# Altium project EG701_BMS.PrjPcb (part 2 of 3)
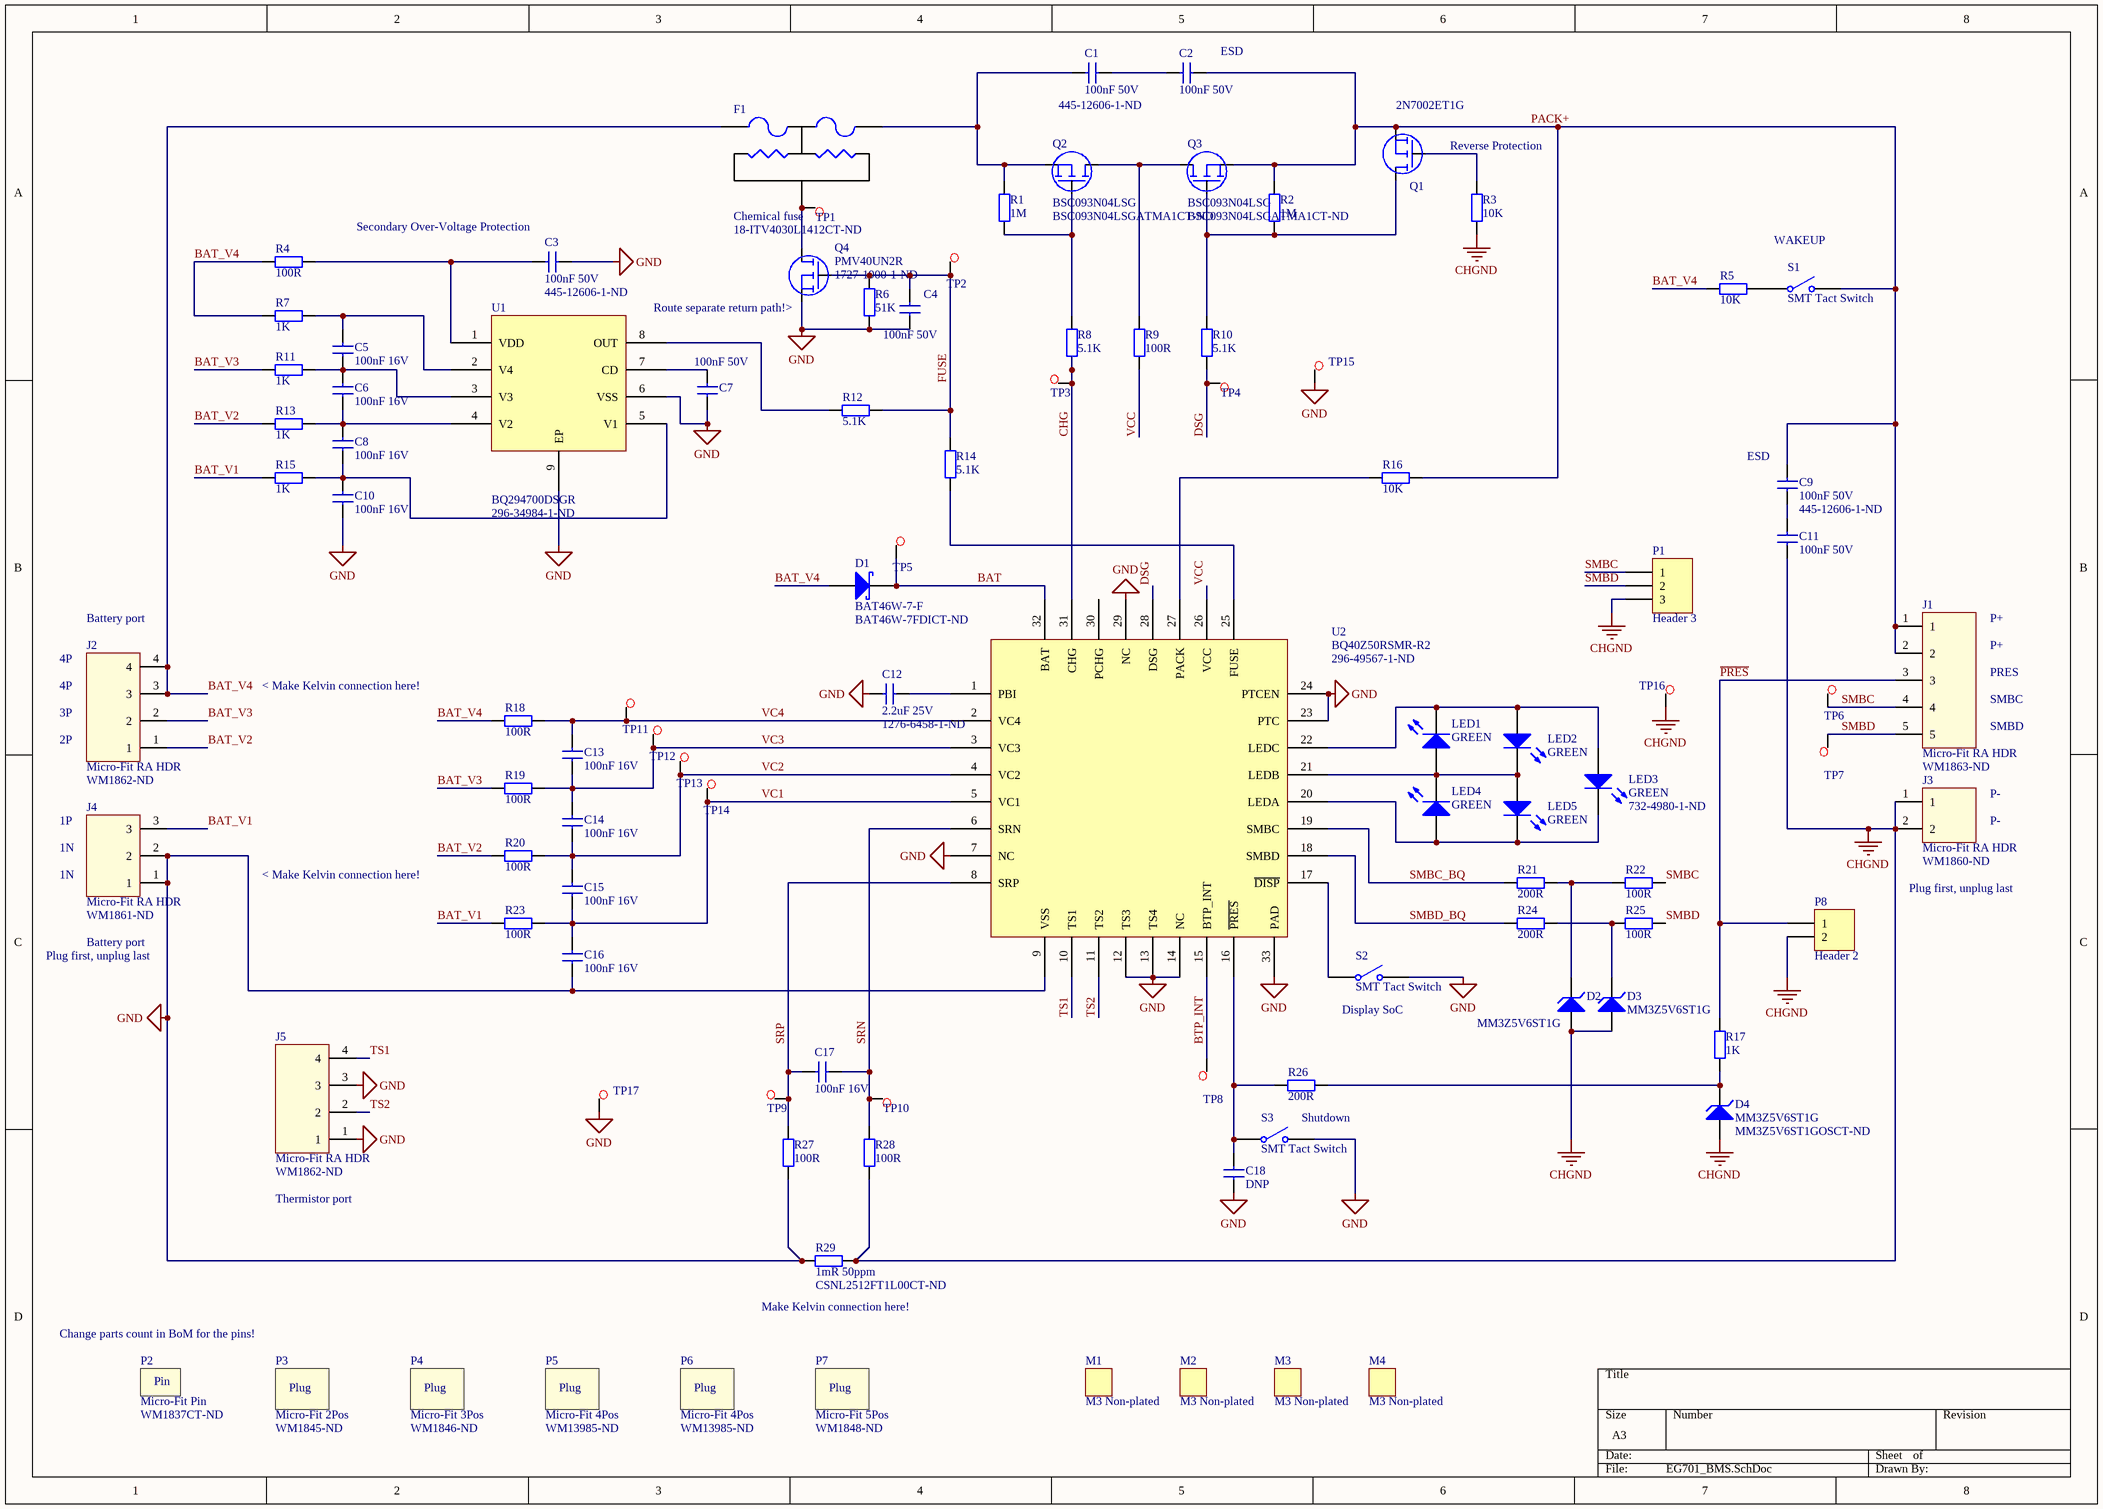
[diagram p1: EG701_BMS.SchDoc]

## Sheet EG701_BMS.SchDoc (continued)
### Library data of the parts
C1-C4 C7 C9 C11 = 100nF_0603_10%_X8R_ 50V: TDK - CGA3E3X8R1H104K080AB - Keramikvielschichtkondensator, SMD, 0.1 µF, 50 V, 0603 [Metrisch 1608], ± 10%, X8R, CGA Series; Supplier 1: Digi-Key; Manufacturer 1: TDK; Manufacturer Part Number 1: CGA3E3X8R1H104K080AB; Stock 1: 311729; Pricing 1: 1=0.23000, 10=0.15900, 100=0.09030, 500=0.06376, 1000=0.05579 (USD); RoHS: Yes; Mount: Surface Mount; Case/Package: 0603; Weight: 7.1E-05oz; Case Code (Imperial): 0603; Case Code (Metric): 1608; Min Operating Temperature: -55°C; Max Operating Temperature: 150°C; Package Quantity: 4000; Packaging: Tape and Reel; Capacitance: 100nF; Tolerance: 10%; Voltage Rating: 50V; Features: High Temperature; Termination: SMD/SMT; Voltage Rating (DC): 50V; Dielectric: X8R; Length: 0.063inch; Height: 0.8mm; Thickness: 0.035inch; Width: 0.8mm; Ratings: AEC-Q200; REACH SVHC: No SVHC; Lead Free: Lead Free; ComponentLink1URL: http://www.mouser.com/ds/2/400/tdk_mlcc_automotive_hightemp_en-549698.pdf?src-supplier=Mouser; ComponentLink1Description: http://www.mouser.com/ds/2/400/tdk_mlcc_automotive_hightemp_en-549698.pdf?src-supplier=Mouser; ComponentLink2URL: http://www.farnell.com/datasheets/2016103.pdf?src-supplier=Farnell; ComponentLink2Description: http://www.farnell.com/datasheets/2016103.pdf?src-supplier=Farnell; ComponentLink3URL: http://product.tdk.com/en/catalog/datasheets/mlcc_automotive_hightemp_en.pdf?src-supplier=Avnet; ComponentLink3Description: http://product.tdk.com/en/catalog/datasheets/mlcc_automotive_hightemp_en.pdf?src-supplier=Avnet; ComponentLink4URL: http://www.farnell.com/datasheets/2016103.pdf?src-supplier=Element14; ComponentLink4Description: http://www.farnell.com/datasheets/2016103.pdf?src-supplier=Element14; ComponentLink5URL: https://product.tdk.com/info/en/documents/chara_sheet/CGA3E3X8R1H104K080AB.pdf?src-supplier=Digi-Key; ComponentLink5Description: https://product.tdk.com/info/en/documents/chara_sheet/CGA3E3X8R1H104K080AB.pdf?src-supplier=Digi-Key; ComponentLink6URL: http://www.farnell.com/datasheets/2016103.pdf?src-supplier=Newark; ComponentLink6Description: http://www.farnell.com/datasheets/2016103.pdf?src-supplier=Newark
  C2 C4 C7 C11: Supplier Part Number 1: 445-12606-1-ND
C5 C6 C8 C10 C13-C17 = 100nF_0603_-20%+80%_Y5V_16V: Cap Ceramic 0.1uF 16V Y5V -20% to 80% SMD 0603 85C Paper T/R; Manufacturer 1: Samsung; Manufacturer Part Number 1: CL10F104ZO8NNNC; Supplier 1: Digi-Key; Stock 1: 7637746; Pricing 1: 1=0.10000, 10=0.03000, 100=0.01360, 500=0.00970, 1000=0.00762 (USD); RoHS: Yes; Mount: Surface Mount; Case/Package: 0603; Case Code (Metric): 1608; Case Code (Imperial): 0603; Min Operating Temperature: -30°C; Max Operating Temperature: 85°C; Capacitance: 100nF; Tolerance: 80%; Package Quantity: 1; Packaging: Tape and Reel; Voltage Rating: 16V; Dielectric: Y5V; Length: 1.6mm; Height: 0.8mm; Width: 0.031inch; Thickness: 0.035inch; Depth: 0.8mm; Radiation Hardening: No; ComponentLink1URL: https://datasheet.ciiva.com/25805/cl10f104zo8nnnc-25805810.pdf?src-supplier=Digi-Key; ComponentLink1Description: https://datasheet.ciiva.com/25805/cl10f104zo8nnnc-25805810.pdf?src-supplier=Digi-Key; ComponentLink2URL: https://datasheet.ciiva.com/16199/cl10f104zo8nnnc-16199254.pdf?src-supplier=Future+Electronics; ComponentLink2Description: https://datasheet.ciiva.com/16199/cl10f104zo8nnnc-16199254.pdf?src-supplier=Future+Electronics; Supplier Part Number 1: 1276-1258-1-ND
C12 = 2U2_0603_10%_X5R_25V: Ceramic capacitor SMD 0805 2.2 µF 25 V 10 %; Manufacturer 1: Samsung; Manufacturer Part Number 1: CL21A225KAFNNNG; Tolerance: 10%; Supplier 1: Digi-Key; Stock 1: 290666; Pricing 1: 1=0.15000, 10=0.10500, 50=0.05940, 100=0.04920, 500=0.03452, 1000=0.02858 (USD); RoHS: Yes; Mount: Surface Mount; Case/Package: 0805; Case Code (Imperial): 0805; Case Code (Metric): 2012; Material: Ceramic; Min Operating Temperature: -55°C; Max Operating Temperature: 85°C; Package Quantity: 3000; Packaging: Tape and Reel; Capacitance: 2.2uF; Voltage Rating: 25V; Length: 0.079inch; Width: 0.049inch; Thickness: 0.053inch; ComponentLink1URL: https://datasheet.ciiva.com/25730/cl21a225kafnnng-25730829.pdf?src-supplier=Digi-Key; ComponentLink1Description: https://datasheet.ciiva.com/25730/cl21a225kafnnng-25730829.pdf?src-supplier=Digi-Key; ComponentLink2URL: https://datasheet.ciiva.com/29199/455579-da-01-en-vs-kondensator-0805-29199247.pdf?src-supplier=Conrad; ComponentLink2Description: https://datasheet.ciiva.com/29199/455579-da-01-en-vs-kondensator-0805-29199247.pdf?src-supplier=Conrad
C18 = SMT_CAP_GENERIC
D1 = BAT46W-7-F: Diode Schottky 100V 0.15A 2Pin SOD123; Manufacturer 1: Diodes; Forward Current: 150mA; Element Configuration: Single; Peak Non-Repetitive Surge Current: 750mA; Forward Voltage: 1V; Peak Reverse Current: 2uA; Power Dissipation: 200mW; Supplier 1: Digi-Key; Manufacturer Part Number 1: BAT46W-7-F; Stock 1: 64763; Pricing 1: 1=0.38000, 10=0.28300, 25=0.24760, 100=0.13430, 250=0.13364, 500=0.10958, 1000=0.08131 (USD); RoHS: Yes; Number of Pins: 2; Weight: 0.000353oz; Contact Plating: Tin,Matte; Min Operating Temperature: -55°C; Max Operating Temperature: 125°C; Max Repetitive Reverse Voltage (Vrrm): 100V; Package Quantity: 3000; Packaging: Tape and Reel; Average Rectified Current: 150mA; Max Forward Surge Current (Ifsm): 750mA; Max Reverse Voltage (DC): 100V; Power Rating: 200mW; Length: 2.85mm; Height: 1.25mm; Width: 1.7mm; Radiation Hardening: No; Lead Free: Lead Free; REACH SVHC: No SVHC; ComponentLink1URL: https://datasheet.ciiva.com/4715/ds30044-73910-4715680.pdf?src-supplier=Mouser; ComponentLink1Description: https://datasheet.ciiva.com/4715/ds30044-73910-4715680.pdf?src-supplier=Mouser; ComponentLink2URL: https://datasheet.ciiva.com/16574/ds30044-16574286.pdf?src-supplier=Avnet+Europe; ComponentLink2Description: https://datasheet.ciiva.com/16574/ds30044-16574286.pdf?src-supplier=Avnet+Europe; ComponentLink3URL: https://datasheet.ciiva.com/8303/ds30044-8303137.pdf?src-supplier=Avnet; ComponentLink3Description: https://datasheet.ciiva.com/8303/ds30044-8303137.pdf?src-supplier=Avnet; ComponentLink4URL: https://datasheet.ciiva.com/6382/ds30044-6382981.pdf?src-supplier=Digi-Key; ComponentLink4Description: https://datasheet.ciiva.com/6382/ds30044-6382981.pdf?src-supplier=Digi-Key; ComponentLink5URL: https://datasheet.ciiva.com/22695/887886-22695798.pdf?src-supplier=Element14; ComponentLink5Description: https://datasheet.ciiva.com/22695/887886-22695798.pdf?src-supplier=Element14; ComponentLink6URL: https://datasheet.ciiva.com/6382/ds30044-6382985.pdf?src-supplier=Digi-Key; ComponentLink6Description: https://datasheet.ciiva.com/6382/ds30044-6382985.pdf?src-supplier=Digi-Key; ComponentLink7URL: https://datasheet.ciiva.com/15144/getdatasheetpartid-89219-15144635.pdf?src-supplier=Verical; ComponentLink7Description: https://datasheet.ciiva.com/15144/getdatasheetpartid-89219-15144635.pdf?src-supplier=Verical; ComponentLink8URL: https://datasheet.ciiva.com/16205/ds30044-16205030.pdf?src-supplier=Future+Electronics; ComponentLink8Description: https://datasheet.ciiva.com/16205/ds30044-16205030.pdf?src-supplier=Future+Electronics; ComponentLink9URL: https://datasheet.ciiva.com/6382/ds30044-6382983.pdf?src-supplier=Digi-Key; ComponentLink9Description: https://datasheet.ciiva.com/6382/ds30044-6382983.pdf?src-supplier=Digi-Key; ComponentLink10URL: https://datasheet.ciiva.com/1177/ds30044-1177855.pdf?src-supplier=Element14; ComponentLink10Description: https://datasheet.ciiva.com/1177/ds30044-1177855.pdf?src-supplier=Element14
D2-D4 = MM3Z5V6ST1G: DIODE ZENER 5.6V 200MW SOD323; Manufacturer 1: ON Semiconductor; Material: Plastic; Tolerance: 2%; Impedance: 40R; Max Reverse Leakage Current: 1uA; Test Current: 5mA; Element Configuration: Single; ESD Protection: Yes; Forward Voltage: 900mV; Zener Current: 10mA; Supplier 1: Digi-Key; Manufacturer Part Number 1: MM3Z5V6ST1G; Stock 1: 337246; Pricing 1: 1=0.13000, 10=0.11800, 25=0.11240, 100=0.04950, 250=0.04752, 500=0.03888, 1000=0.02700 (USD); RoHS: Yes; Case/Package: SOD-323-2; Number of Pins: 2; Contact Plating: Tin,Matte; Min Operating Temperature: -65°C; Max Operating Temperature: 150°C; Packaging: Tape and Reel; Package Quantity: 1; Max Power Dissipation: 200mW; Zener Voltage: 5.6V; Voltage Tolerance: 2%; Voltage Rating (DC): 5.6V; Power Rating: 200mW; Power Dissipation: 200mW; Working Voltage: 5.6V; Peak Reverse Current: 1uA; Length: 1.8mm; Height: 1mm; Width: 1.35mm; Radiation Hardening: No; Lead Free: Lead Free; REACH SVHC: No SVHC; ComponentLink1URL: https://datasheet.ciiva.com/894/mm3z2v4st1-d-894656.pdf?src-supplier=Digi-Key; ComponentLink1Description: https://datasheet.ciiva.com/894/mm3z2v4st1-d-894656.pdf?src-supplier=Digi-Key; ComponentLink2URL: https://datasheet.ciiva.com/30478/0900766b8127c8bd-30478396.pdf?src-supplier=RSComponents; ComponentLink2Description: https://datasheet.ciiva.com/30478/0900766b8127c8bd-30478396.pdf?src-supplier=RSComponents; ComponentLink3URL: https://datasheet.ciiva.com/15141/getdatasheetpartid-38592-15141978.pdf?src-supplier=Verical; ComponentLink3Description: https://datasheet.ciiva.com/15141/getdatasheetpartid-38592-15141978.pdf?src-supplier=Verical; ComponentLink4URL: https://datasheet.ciiva.com/894/mm3z2v4st1-d-894657.pdf?src-supplier=Digi-Key; ComponentLink4Description: https://datasheet.ciiva.com/894/mm3z2v4st1-d-894657.pdf?src-supplier=Digi-Key; ComponentLink5URL: https://datasheet.ciiva.com/26093/mm3z2v4st1-d-26093062.pdf?src-supplier=Avnet+Europe; ComponentLink5Description: https://datasheet.ciiva.com/26093/mm3z2v4st1-d-26093062.pdf?src-supplier=Avnet+Europe; ComponentLink6URL: https://datasheet.ciiva.com/894/mm3z2v4st1-d-894655.pdf?src-supplier=Digi-Key; ComponentLink6Description: https://datasheet.ciiva.com/894/mm3z2v4st1-d-894655.pdf?src-supplier=Digi-Key; ComponentLink7URL: https://datasheet.ciiva.com/16202/mm3z2v4t1-d-16202392.pdf?src-supplier=Future+Electronics; ComponentLink7Description: https://datasheet.ciiva.com/16202/mm3z2v4t1-d-16202392.pdf?src-supplier=Future+Electronics
  D2 D3: Supplier Part Number 1: MM3Z5V6ST1GOSCT-ND
F1 = ITV4030L1412: 36V 12A controllable fuse; Manufacturer 1: Littelfuse; Supplier 1: Digi-Key; Manufacturer Part Number 1: ITV4030L1412; Stock 1: 4981; Pricing 1: 1=4.52000, 5=4.36400, 10=4.20800, 50=3.27260, 100=2.72710, 250=2.64924, 500=2.25964, 1000=2.14276 (USD); RoHS: No; ComponentLink1Description: datasheet; ComponentLink1URL: https://m.littelfuse.com/~/media/electronics/datasheets/resettable_ptcs/littelfuse_battery_protectors_itv4030_12a_datasheet.pdf.pdf
J1 = 43650-0500: CONN HEADER R/A 5POS 3MM; Manufacturer 1: Molex Waldom; Number of Positions: 5; Gender: Male; Voltage Rating (DC): 250V; Current Rating: 5A; Glow Wire Compliant: Compliant; Supplier 1: Digi-Key; Manufacturer Part Number 1: 43650-0500; Stock 1: 4169; Pricing 1: 1=1.54000, 10=1.39500, 100=1.19550, 500=0.99628, 1000=0.85395, 5000=0.75717, 10000=0.74009 (USD); RoHS: No; Color: Black; Contact Material: Brass; Housing Color: Black; Contact Plating: Tin; Housing Material: Thermoplastic; Orientation: Right Angle; Packaging: Tray; Number of Contacts: 5; Number of Rows: 1; Number of Circuits: 5; Length: 18.6mm; Height: 4.37mm; Width: 9.9mm; Flammability Rating: UL94 V-0; Halogen Free: Low Halogen; Lead Free: Contains Lead; ComponentLink1URL: https://datasheet.ciiva.com/24411/0436500500-pcb-headers-24411329.pdf?src-supplier=Onlinecomponents.com; ComponentLink1Description: https://datasheet.ciiva.com/24411/0436500500-pcb-headers-24411329.pdf?src-supplier=Onlinecomponents.com
J2 J5 = 43650-0400: MOLEX         43650-0400             Wire-To-Board Connector, Micro-Fit 3.0 43650 Series, Solder, Header, 4 Contacts, 3 mm; Connector Type: Plug,Socket; Number of Positions: 4; Gender: Male; Voltage Rating (DC): 250V; Max Voltage Rating (AC): 600V; Current Rating: 5A; Contact Resistance: 10mR; Pitch: 3mm; Glow Wire Compliant: Compliant; Supplier 1: Digi-Key; Manufacturer 1: Molex; Manufacturer Part Number 1: 43650-0400; Stock 1: 6849; Pricing 1: 1=1.36000, 10=1.23000, 100=1.05400, 500=0.87832, 1000=0.75285, 5000=0.66753, 10000=0.65247 (USD); RoHS: Yes; Mount: Through Hole,Cable; Color: Black; Housing Material: Thermoplastic; Contact Material: Brass,Copper Alloy; Contact Plating: Tin,Bright; Housing Color: Black; Min Operating Temperature: -40°C; Max Operating Temperature: 105°C; Termination: Solder; Number of Contacts: 4; Orientation: Right Angle; Number of Rows: 1; Packaging: Tray; Number of Circuits: 4; Voltage Rating: 600V; Package Quantity: 2380; Length: 14.86mm; Height: 4.5mm; Depth: 3.6mm; Radiation Hardening: No; Flammability Rating: UL94 V-0; Halogen Free: Low Halogen; Lead Free: Contains Lead; REACH SVHC: Unknown; ComponentLink1URL: https://datasheet.ciiva.com/11748/0900766b80d6135b-11748178.pdf?src-supplier=RSComponents; ComponentLink1Description: https://datasheet.ciiva.com/11748/0900766b80d6135b-11748178.pdf?src-supplier=RSComponents; ComponentLink2URL: https://datasheet.ciiva.com/16085/0436500400-pcb-headers-16085752.pdf?src-supplier=Onlinecomponents.com; ComponentLink2Description: https://datasheet.ciiva.com/16085/0436500400-pcb-headers-16085752.pdf?src-supplier=Onlinecomponents.com; ComponentLink3URL: https://datasheet.ciiva.com/5151/0436500400-pcb-headers-148663-5151881.pdf?src-supplier=Mouser; ComponentLink3Description: https://datasheet.ciiva.com/5151/0436500400-pcb-headers-148663-5151881.pdf?src-supplier=Mouser; ComponentLink4URL: https://datasheet.ciiva.com/19462/884184-19462234.pdf?src-supplier=Jameco; ComponentLink4Description: https://datasheet.ciiva.com/19462/884184-19462234.pdf?src-supplier=Jameco; ComponentLink5URL: https://datasheet.ciiva.com/9449/0436500400-pcb-headers-9449446.pdf?src-supplier=Avnet; ComponentLink5Description: https://datasheet.ciiva.com/9449/0436500400-pcb-headers-9449446.pdf?src-supplier=Avnet; ComponentLink6URL: https://datasheet.ciiva.com/17080/70266896-17080471.pdf?src-supplier=Allied+Electronics; ComponentLink6Description: https://datasheet.ciiva.com/17080/70266896-17080471.pdf?src-supplier=Allied+Electronics; ComponentLink7URL: https://datasheet.ciiva.com/16654/0436500400-pcb-headers-16654968.pdf?src-supplier=Avnet+Europe; ComponentLink7Description: https://datasheet.ciiva.com/16654/0436500400-pcb-headers-16654968.pdf?src-supplier=Avnet+Europe; ComponentLink8URL: https://datasheet.ciiva.com/7094/1946229-7094763.pdf?src-supplier=Newark; ComponentLink8Description: https://datasheet.ciiva.com/7094/1946229-7094763.pdf?src-supplier=Newark; ComponentLink9URL: https://datasheet.ciiva.com/30221/142510436500400-pcb-headers-30221164.pdf?src-supplier=Onlinecomponents.com; ComponentLink9Description: https://datasheet.ciiva.com/30221/142510436500400-pcb-headers-30221164.pdf?src-supplier=Onlinecomponents.com
J3 = 43650-0200: MOLEX   43650-0200   HEADER, R/A, SINGLE ROW, 2 WAY; Contact Resistance: 10mR; Number of Positions: 2; Connector Type: Plug,Socket; Current Rating: 5A; Voltage Rating (AC): 250V; Voltage Rating: 600V; Gender: Male; Insulation Resistance: 1GR; Pitch: 3mm; Glow Wire Compliant: Compliant; Supplier 1: Digi-Key; Manufacturer 1: Molex; Manufacturer Part Number 1: 43650-0200; Stock 1: 15790; Pricing 1: 1=0.96000, 10=0.84100, 100=0.72560, 500=0.59364, 1000=0.52768, 5000=0.46172, 10000=0.43863 (USD); RoHS: Yes; Mount: Through Hole; Contact Plating: Tin; Contact Material: Brass,Tin; Color: Black; Housing Color: Black; Housing Material: Thermoplastic; Min Operating Temperature: -40°C; Max Operating Temperature: 105°C; Number of Rows: 1; Packaging: Tray; Termination: Solder; Number of Contacts: 2; Orientation: Right Angle; Package Quantity: 3927; Working Voltage: 250V; Number of Circuits: 2; Voltage Rating (DC): 250V; Length: 9.65mm; Height: 5.57mm; Depth: 9.9mm; Radiation Hardening: No; Flammability Rating: UL94 V-0; REACH SVHC: Unknown; Halogen Free: Low Halogen; Lead Free: Lead Free; ComponentLink1URL: https://datasheet.ciiva.com/14155/04402066-14155224.pdf?src-supplier=Distrelec; ComponentLink1Description: https://datasheet.ciiva.com/14155/04402066-14155224.pdf?src-supplier=Distrelec; ComponentLink2URL: https://datasheet.ciiva.com/5158/0436500200-pcb-headers-148844-5158523.pdf?src-supplier=Mouser; ComponentLink2Description: https://datasheet.ciiva.com/5158/0436500200-pcb-headers-148844-5158523.pdf?src-supplier=Mouser; ComponentLink3URL: https://datasheet.ciiva.com/11748/0900766b80d6135b-11748140.pdf?src-supplier=RSComponents; ComponentLink3Description: https://datasheet.ciiva.com/11748/0900766b80d6135b-11748140.pdf?src-supplier=RSComponents; ComponentLink4URL: https://datasheet.ciiva.com/22683/1709823-22683551.pdf?src-supplier=Element14; ComponentLink4Description: https://datasheet.ciiva.com/22683/1709823-22683551.pdf?src-supplier=Element14; ComponentLink5URL: https://datasheet.ciiva.com/30161/48630436500200-pcb-headers-30161343.pdf?src-supplier=Onlinecomponents.com; ComponentLink5Description: https://datasheet.ciiva.com/30161/48630436500200-pcb-headers-30161343.pdf?src-supplier=Onlinecomponents.com; ComponentLink6URL: https://datasheet.ciiva.com/9432/0436500200-pcb-headers-9432849.pdf?src-supplier=Avnet; ComponentLink6Description: https://datasheet.ciiva.com/9432/0436500200-pcb-headers-9432849.pdf?src-supplier=Avnet; ComponentLink7URL: https://datasheet.ciiva.com/16089/1029720436500200-pcb-headers-16089218.pdf?src-supplier=Onlinecomponents.com; ComponentLink7Description: https://datasheet.ciiva.com/16089/1029720436500200-pcb-headers-16089218.pdf?src-supplier=Onlinecomponents.com; ComponentLink8URL: https://datasheet.ciiva.com/7920/1839562-7920756.pdf?src-supplier=Element14; ComponentLink8Description: https://datasheet.ciiva.com/7920/1839562-7920756.pdf?src-supplier=Element14; ComponentLink9URL: https://datasheet.ciiva.com/19462/884053-19462312.pdf?src-supplier=Jameco; ComponentLink9Description: https://datasheet.ciiva.com/19462/884053-19462312.pdf?src-supplier=Jameco; ComponentLink10URL: https://datasheet.ciiva.com/16654/0436500200-pcb-headers-16654958.pdf?src-supplier=Avnet+Europe; ComponentLink10Description: https://datasheet.ciiva.com/16654/0436500200-pcb-headers-16654958.pdf?src-supplier=Avnet+Europe
J4 = 43650-0300: MOLEX - 43650-0300 - Wire-To-Board-Steckverbinder, 3 mm, 3 Kontakt(e), Stiftleiste, Baureihe Micro-Fit 3.0 43650; Number of Positions: 3; Contact Resistance: 10mR; Connector Type: Power,Rectangular; Max Voltage Rating (AC): 250V; Gender: Male; Insulation Resistance: 1GR; Voltage Rating: 600V; Current Rating: 5A; Pitch: 3mm; Glow Wire Compliant: Compliant; Supplier 1: Digi-Key; Manufacturer 1: Molex; Manufacturer Part Number 1: 43650-0300; Stock 1: 35363; Pricing 1: 1=1.10000, 10=0.96400, 100=0.83160, 500=0.68040, 1000=0.60480, 5000=0.52920, 10000=0.50274 (USD); RoHS: Yes; Mount: Through Hole,PCB; Color: Black; Housing Color: Black; Contact Material: Brass,Tin; Contact Plating: Tin,Lead,Bright; Housing Material: Thermoplastic; Min Operating Temperature: -40°C; Max Operating Temperature: 105°C; Termination: Solder; Orientation: Right Angle; Number of Rows: 1; Packaging: Tray; Number of Contacts: 3; Working Voltage: 250V; Voltage Rating (DC): 250V; Number of Circuits: 3; Number of Poles: 3; Package Quantity: 2975; Voltage Rating (AC): 250V; Max Current Rating: 5A; Length: 12.65mm; Height: 14.4mm; Depth: 9.9mm; Radiation Hardening: No; REACH SVHC: Unknown; Halogen Free: Low Halogen; Lead Free: Lead Free; Flammability Rating: UL94 V-0; ComponentLink1URL: https://datasheet.ciiva.com/30189/0436500300-pcb-headers-30189026.pdf?src-supplier=Onlinecomponents.com; ComponentLink1Description: https://datasheet.ciiva.com/30189/0436500300-pcb-headers-30189026.pdf?src-supplier=Onlinecomponents.com; ComponentLink2URL: https://datasheet.ciiva.com/16089/437910436500300-pcb-headers-16089189.pdf?src-supplier=Onlinecomponents.com; ComponentLink2Description: https://datasheet.ciiva.com/16089/437910436500300-pcb-headers-16089189.pdf?src-supplier=Onlinecomponents.com; ComponentLink3URL: https://datasheet.ciiva.com/5153/0436500300-pcb-headers-148847-5153495.pdf?src-supplier=Mouser; ComponentLink3Description: https://datasheet.ciiva.com/5153/0436500300-pcb-headers-148847-5153495.pdf?src-supplier=Mouser; ComponentLink4URL: https://datasheet.ciiva.com/11747/0900766b80d6135b-11747857.pdf?src-supplier=RSComponents; ComponentLink4Description: https://datasheet.ciiva.com/11747/0900766b80d6135b-11747857.pdf?src-supplier=RSComponents; ComponentLink5URL: https://datasheet.ciiva.com/16654/0436500300-pcb-headers-16654467.pdf?src-supplier=Avnet+Europe; ComponentLink5Description: https://datasheet.ciiva.com/16654/0436500300-pcb-headers-16654467.pdf?src-supplier=Avnet+Europe; ComponentLink6URL: https://datasheet.ciiva.com/19462/884141-19462202.pdf?src-supplier=Jameco; ComponentLink6Description: https://datasheet.ciiva.com/19462/884141-19462202.pdf?src-supplier=Jameco; ComponentLink7URL: https://datasheet.ciiva.com/9432/0436500300-pcb-headers-9432853.pdf?src-supplier=Avnet; ComponentLink7Description: https://datasheet.ciiva.com/9432/0436500300-pcb-headers-9432853.pdf?src-supplier=Avnet
LED1-LED5 = 150060VS75000: WURTH ELEKTRONIK - 150060VS75000 - LED, 0603, B GREEN,  40MCD, 570NM; Manufacturer 1: Wurth Electronics; Viewing Angle: 140°; Forward Voltage: 2V; Lens Style: Clear,Rectangular; Forward Current: 30mA; Test Current: 20mA; Supplier 1: Digi-Key; Manufacturer Part Number 1: 150060VS75000; Stock 1: 61699; Pricing 1: 1=0.14000, 50=0.13300, 100=0.11400, 500=0.09900 (USD); RoHS: Yes; Mount: Surface Mount; Case/Package: 0603; Number of Pins: 2; Color: Green; Case Code (Metric): 1608; Case Code (Imperial): 0603; Min Operating Temperature: -40°C; Max Operating Temperature: 85°C; Package Quantity: 1; Packaging: Tape and Reel; Luminous Intensity: 40mcd; Wavelength: 570nm; Dominant Wavelength: 570nm; Length: 1.6mm; Height: 0.7mm; Width: 0.8mm; REACH SVHC: Unknown; ComponentLink1URL: https://datasheet.ciiva.com/23843/150060vs75000-23843249.pdf?src-supplier=Newark; ComponentLink1Description: https://datasheet.ciiva.com/23843/150060vs75000-23843249.pdf?src-supplier=Newark; ComponentLink2URL: https://datasheet.ciiva.com/29279/759431-da-01-en-chipled-0603-w-kl-h-gruen-150060vs7500-29279199.pdf?src-supplier=Conrad; ComponentLink2Description: https://datasheet.ciiva.com/29279/759431-da-01-en-chipled-0603-w-kl-h-gruen-150060vs7500-29279199.pdf?src-supplier=Conrad; ComponentLink3URL: https://datasheet.ciiva.com/29562/150060vs75000-29562919.pdf?src-supplier=Digi-Key; ComponentLink3Description: https://datasheet.ciiva.com/29562/150060vs75000-29562919.pdf?src-supplier=Digi-Key; ComponentLink4URL: https://datasheet.ciiva.com/29562/150060vs75000-29562920.pdf?src-supplier=Digi-Key; ComponentLink4Description: https://datasheet.ciiva.com/29562/150060vs75000-29562920.pdf?src-supplier=Digi-Key; ComponentLink5URL: https://datasheet.ciiva.com/29562/150060vs75000-29562921.pdf?src-supplier=Digi-Key; ComponentLink5Description: https://datasheet.ciiva.com/29562/150060vs75000-29562921.pdf?src-supplier=Digi-Key; ComponentLink6URL: https://datasheet.ciiva.com/48430/150060vs75000-eng-tds-48430043.pdf?src-supplier=Distrelec; ComponentLink6Description: https://datasheet.ciiva.com/48430/150060vs75000-eng-tds-48430043.pdf?src-supplier=Distrelec
M1-M4 = M3_NONPLATED: Non-plated mounting hole, M3
P1 = HDR3: Header, 3-Pin; LatestRevisionDate: 17-Jul-2002; LatestRevisionNote: Re-released for DXP Platform.; Publisher: Altium Limited
P2 = 43030-0001: microfit 3.0 female crimp terminal 20-24 awg; Manufacturer 1: Molex; Connector Type: Connector,PCB,Signal,Power,Crimp,Socket; Current Rating: 5A; Contact Resistance: 10mR; Voltage Rating: 250V; Shielding: Unshielded; Wire Gauge (Max): 20AWG; Wire Gauge (Min): 24AWG; Glow Wire Compliant: Non-compliant; Supplier 1: Digi-Key; Manufacturer Part Number 1: 43030-0001; Stock 1: 910268; Pricing 1: 1=0.11000, 10=0.10800, 25=0.08000, 50=0.06860, 100=0.06640, 250=0.05720, 500=0.05492, 1000=0.04805, 2500=0.04347 (USD); RoHS: Yes; Mount: Cable; Case/Package: 0001; Contact Plating: Tin; Contact Material: Bronze,Tin; Min Operating Temperature: -40°C; Max Operating Temperature: 105°C; Termination: Crimp; Packaging: Tape and Reel; Number of Rows: 2; Orientation: Straight; Package Quantity: 12000; Gender: Female; Contact Gender: Female; Max Current Rating: 5A; Voltage Rating (DC): 250V; Length: 11mm; Height: 2.29mm; Depth: 2.54mm; Wire/Cable Gauge: 24AWG; Radiation Hardening: No; Lead Free: Lead Free; REACH SVHC: Unknown; Halogen Free: Low Halogen; ComponentLink1URL: https://datasheet.ciiva.com/25907/0430300001-crimp-terminals-25907746.pdf?src-supplier=Avnet+Europe; ComponentLink1Description: https://datasheet.ciiva.com/25907/0430300001-crimp-terminals-25907746.pdf?src-supplier=Avnet+Europe; ComponentLink2URL: https://datasheet.ciiva.com/16134/1669030430300001-crimp-terminals-16134517.pdf?src-supplier=Onlinecomponents.com; ComponentLink2Description: https://datasheet.ciiva.com/16134/1669030430300001-crimp-terminals-16134517.pdf?src-supplier=Onlinecomponents.com; ComponentLink3URL: https://datasheet.ciiva.com/28644/1710118-28644501.pdf?src-supplier=Element14; ComponentLink3Description: https://datasheet.ciiva.com/28644/1710118-28644501.pdf?src-supplier=Element14; ComponentLink4URL: https://datasheet.ciiva.com/3916/100050430300001-crimp-terminals-3916634.pdf?src-supplier=Arrow+Electronics; ComponentLink4Description: https://datasheet.ciiva.com/3916/100050430300001-crimp-terminals-3916634.pdf?src-supplier=Arrow+Electronics; ComponentLink5URL: https://datasheet.ciiva.com/30259/0430300001-crimp-terminals-30259530.pdf?src-supplier=Onlinecomponents.com; ComponentLink5Description: https://datasheet.ciiva.com/30259/0430300001-crimp-terminals-30259530.pdf?src-supplier=Onlinecomponents.com; ComponentLink6URL: https://datasheet.ciiva.com/34303/1931851-34303323.pdf?src-supplier=Jameco; ComponentLink6Description: https://datasheet.ciiva.com/34303/1931851-34303323.pdf?src-supplier=Jameco; ComponentLink7URL: https://datasheet.ciiva.com/11721/0900766b80d5b250-11721212.pdf?src-supplier=RSComponents; ComponentLink7Description: https://datasheet.ciiva.com/11721/0900766b80d5b250-11721212.pdf?src-supplier=RSComponents; ComponentLink8URL: https://datasheet.ciiva.com/5156/0430300001-crimp-terminals-5156149.pdf?src-supplier=Mouser; ComponentLink8Description: https://datasheet.ciiva.com/5156/0430300001-crimp-terminals-5156149.pdf?src-supplier=Mouser; ComponentLink9URL: https://datasheet.ciiva.com/32422/04402477-1-32422378.pdf?src-supplier=Distrelec; ComponentLink9Description: https://datasheet.ciiva.com/32422/04402477-1-32422378.pdf?src-supplier=Distrelec; ComponentLink10URL: https://datasheet.ciiva.com/10409/0430300001-crimp-terminals-10409455.pdf?src-supplier=Avnet; ComponentLink10Description: https://datasheet.ciiva.com/10409/0430300001-crimp-terminals-10409455.pdf?src-supplier=Avnet
P3 = 43645-0200: Female contact housing single row 3 mm Pole no. 1x2 Micro-Fit, 43645-0200, Molex; Connector Type: Socket,Power,Rectangular; Number of Positions: 2; Gender: Receptacle; Current Rating: 5A; Voltage Rating: 600V; Contact Resistance: 10MR; Voltage Rating (AC): 250V; Pitch: 3mm; Glow Wire Compliant: Non-compliant; Approvals: UL,CSA,TUV; Supplier 1: Digi-Key; Manufacturer 1: Molex; Manufacturer Part Number 1: 43645-0200; Stock 1: 146748; Pricing 1: 1=0.32000, 10=0.30600, 25=0.26240, 50=0.22280, 100=0.21410, 250=0.19228, 500=0.18354, 1000=0.15295, 2500=0.13984 (USD); RoHS: Yes; Mount: Free Hanging,Cable; Color: Black; Housing Material: Nylon; Contact Material: Bronze; Contact Plating: Nickel; Housing Color: Black; Material: Polyester; Min Operating Temperature: -40°C; Max Operating Temperature: 105°C; Packaging: Bulk; Termination: Crimp; Orientation: Straight; Number of Rows: 1; Number of Contacts: 2; Package Quantity: 5000; Number of Circuits: 2; Number of Poles: 2; Working Voltage: 250V; Length: 8.28mm; Height: 5.3mm; Depth: 14mm; Radiation Hardening: No; Flammability Rating: UL94 V-0; REACH SVHC: Unknown; Halogen Free: Low Halogen; Lead Free: Lead Free; ComponentLink1URL: https://datasheet.ciiva.com/16661/0436450200-crimp-housings-16661793.pdf?src-supplier=Avnet+Europe; ComponentLink1Description: https://datasheet.ciiva.com/16661/0436450200-crimp-housings-16661793.pdf?src-supplier=Avnet+Europe; ComponentLink2URL: https://datasheet.ciiva.com/16127/0436450200-crimp-housings-16127842.pdf?src-supplier=Onlinecomponents.com; ComponentLink2Description: https://datasheet.ciiva.com/16127/0436450200-crimp-housings-16127842.pdf?src-supplier=Onlinecomponents.com; ComponentLink3URL: https://datasheet.ciiva.com/15178/getdatasheetpartid-152868-15178725.pdf?src-supplier=Verical; ComponentLink3Description: https://datasheet.ciiva.com/15178/getdatasheetpartid-152868-15178725.pdf?src-supplier=Verical; ComponentLink4URL: https://datasheet.ciiva.com/5158/0436450200-crimp-housings-148631-5158919.pdf?src-supplier=Mouser; ComponentLink4Description: https://datasheet.ciiva.com/5158/0436450200-crimp-housings-148631-5158919.pdf?src-supplier=Mouser; ComponentLink5URL: https://datasheet.ciiva.com/19472/883974-19472986.pdf?src-supplier=Jameco; ComponentLink5Description: https://datasheet.ciiva.com/19472/883974-19472986.pdf?src-supplier=Jameco; ComponentLink6URL: https://datasheet.ciiva.com/11718/0900766b8024dedf-11718029.pdf?src-supplier=RSComponents; ComponentLink6Description: https://datasheet.ciiva.com/11718/0900766b8024dedf-11718029.pdf?src-supplier=RSComponents; ComponentLink7URL: https://datasheet.ciiva.com/1446/1898109-1446803.pdf?src-supplier=Element14; ComponentLink7Description: https://datasheet.ciiva.com/1446/1898109-1446803.pdf?src-supplier=Element14; ComponentLink8URL: https://datasheet.ciiva.com/14155/04401883-14155295.pdf?src-supplier=Distrelec; ComponentLink8Description: https://datasheet.ciiva.com/14155/04401883-14155295.pdf?src-supplier=Distrelec
P4 = 43645-0300: MICRO-FIT 3.0 Series 3mm Pitch 3 Way 1 Row Female Straight PCB Housing 43645; Manufacturer 1: Molex; Connector Type: Socket,Power,Rectangular; Number of Positions: 3; Gender: Receptacle; Current Rating: 5A; Voltage Rating: 600V; Contact Resistance: 10MR; Voltage Rating (AC): 250V; Glow Wire Compliant: Non-compliant; Approvals: UL,CSA,TUV; Supplier 1: Digi-Key; Manufacturer Part Number 1: 43645-0300; Stock 1: 82426; Pricing 1: 1=0.38000, 10=0.36000, 25=0.30880, 50=0.26240, 100=0.25210, 250=0.22640, 500=0.21610, 1000=0.18008, 2500=0.16464 (USD); RoHS: Yes; Mount: Free Hanging; Color: Black; Housing Material: Polyester; Contact Material: Bronze; Contact Plating: Nickel; Housing Color: Black; Material: Polyester; Min Operating Temperature: -40°C; Max Operating Temperature: 105°C; Packaging: Bulk; Termination: Crimp; Orientation: Straight; Number of Rows: 1; Number of Contacts: 3; Package Quantity: 5000; Number of Circuits: 3; Number of Poles: 3; Working Voltage: 250V; Length: 9.85mm; Height: 5.3mm; Pitch: 3mm; Depth: 14mm; Radiation Hardening: No; Flammability Rating: UL94 V-0; Lead Free: Lead Free; REACH SVHC: Unknown; Halogen Free: Low Halogen; ComponentLink1URL: https://datasheet.ciiva.com/5157/0436450300-crimp-housings-148841-5157922.pdf?src-supplier=Mouser; ComponentLink1Description: https://datasheet.ciiva.com/5157/0436450300-crimp-housings-148841-5157922.pdf?src-supplier=Mouser; ComponentLink2URL: https://datasheet.ciiva.com/19473/883991-19473715.pdf?src-supplier=Jameco; ComponentLink2Description: https://datasheet.ciiva.com/19473/883991-19473715.pdf?src-supplier=Jameco; ComponentLink3URL: https://datasheet.ciiva.com/16661/0436450300-crimp-housings-16661794.pdf?src-supplier=Avnet+Europe; ComponentLink3Description: https://datasheet.ciiva.com/16661/0436450300-crimp-housings-16661794.pdf?src-supplier=Avnet+Europe; ComponentLink4URL: https://datasheet.ciiva.com/11718/0900766b8024dedf-11718164.pdf?src-supplier=RSComponents; ComponentLink4Description: https://datasheet.ciiva.com/11718/0900766b8024dedf-11718164.pdf?src-supplier=RSComponents; ComponentLink5URL: https://datasheet.ciiva.com/16127/0436450300-crimp-housings-16127846.pdf?src-supplier=Onlinecomponents.com; ComponentLink5Description: https://datasheet.ciiva.com/16127/0436450300-crimp-housings-16127846.pdf?src-supplier=Onlinecomponents.com; ComponentLink6URL: https://datasheet.ciiva.com/14155/04401883-14155256.pdf?src-supplier=Distrelec; ComponentLink6Description: https://datasheet.ciiva.com/14155/04401883-14155256.pdf?src-supplier=Distrelec; ComponentLink7URL: https://datasheet.ciiva.com/1446/1898110-1446884.pdf?src-supplier=Element14; ComponentLink7Description: https://datasheet.ciiva.com/1446/1898110-1446884.pdf?src-supplier=Element14; ComponentLink8URL: https://datasheet.ciiva.com/45847/97750436450300-crimp-housings-45847222.pdf?src-supplier=Onlinecomponents.com; ComponentLink8Description: https://datasheet.ciiva.com/45847/97750436450300-crimp-housings-45847222.pdf?src-supplier=Onlinecomponents.com; ComponentLink9URL: https://datasheet.ciiva.com/18453/70190864-18453659.pdf?src-supplier=Allied+Electronics; ComponentLink9Description: https://datasheet.ciiva.com/18453/70190864-18453659.pdf?src-supplier=Allied+Electronics; ComponentLink10URL: https://datasheet.ciiva.com/16660/0436450300-crimp-housings-16660890.pdf?src-supplier=Avnet+Europe; ComponentLink10Description: https://datasheet.ciiva.com/16660/0436450300-crimp-housings-16660890.pdf?src-supplier=Avnet+Europe; ComponentLink11URL: https://datasheet.ciiva.com/10392/0436450300-crimp-housings-10392092.pdf?src-supplier=Avnet; ComponentLink11Description: https://datasheet.ciiva.com/10392/0436450300-crimp-housings-10392092.pdf?src-supplier=Avnet
P5 P6 = 43645-0408: Conn Housing F 4 POS 3mm Crimp ST Cable Mount Micro-Fit 3.0™ Bag; Manufacturer 1: Molex; Manufacturer Part Number 1: 0436450408; Connector Type: Receptacle,Socket; Number of Positions: 4; Gender: Female; Supplier 1: Digi-Key; Stock 1: 10634; Pricing 1: 1=0.51000, 10=0.47600, 25=0.42880, 50=0.38120, 100=0.36520, 250=0.33348, 500=0.31760, 1000=0.26202, 2500=0.23820 (USD); RoHS: Yes; Mount: Free Hanging; Color: Black; Packaging: Bulk; Number of Rows: 1; Orientation: Straight; Package Quantity: 3000; Number of Contacts: 4; Fastening Type: Latch; Termination: Crimp; Length: 12.85mm; Pitch: 3mm; Depth: 14mm; Radiation Hardening: No; ComponentLink1URL: https://datasheet.ciiva.com/6793/436450608-sd-6793924.pdf?src-supplier=Digi-Key; ComponentLink1Description: https://datasheet.ciiva.com/6793/436450608-sd-6793924.pdf?src-supplier=Digi-Key; ComponentLink2URL: https://datasheet.ciiva.com/3923/279960436450408-crimp-housings-3923345.pdf?src-supplier=Arrow+Electronics; ComponentLink2Description: https://datasheet.ciiva.com/3923/279960436450408-crimp-housings-3923345.pdf?src-supplier=Arrow+Electronics
P7 = 43645-0500: GLOVE, POLYAMIDE, L/FREE, PU, SIZE 6 - More Details; Manufacturer 1: Molex; Number of Positions: 5; Gender: Female; Current Rating: 5A; Voltage Rating: 600V; Pitch: 3mm; Glow Wire Compliant: Non-compliant; Approvals: UL,CSA,TUV; Supplier 1: Digi-Key; Manufacturer Part Number 1: 43645-0500; Stock 1: 18539; Pricing 1: 1=0.42000, 10=0.39000, 25=0.35120, 50=0.31220, 100=0.29920, 250=0.27320, 500=0.26020, 1000=0.21467, 2500=0.19515 (USD); RoHS: Yes; Mount: Cable; Color: Black; Housing Material: Polyester; Housing Color: Black; Min Operating Temperature: -40°C; Max Operating Temperature: 105°C; Packaging: Bulk; Termination: Crimp; Orientation: Straight; Number of Rows: 1; Number of Contacts: 5; Package Quantity: 2500; Number of Circuits: 5; Contact Gender: Female; Length: 15.85mm; Height: 5.3mm; Depth: 14mm; Radiation Hardening: No; Flammability Rating: UL94 V-0; Lead Free: Lead Free; REACH SVHC: Unknown; ComponentLink1URL: https://datasheet.ciiva.com/30243/0436450500-crimp-housings-30243008.pdf?src-supplier=Onlinecomponents.com; ComponentLink1Description: https://datasheet.ciiva.com/30243/0436450500-crimp-housings-30243008.pdf?src-supplier=Onlinecomponents.com; ComponentLink2URL: https://datasheet.ciiva.com/10401/0436450500-crimp-housings-10401377.pdf?src-supplier=Avnet; ComponentLink2Description: https://datasheet.ciiva.com/10401/0436450500-crimp-housings-10401377.pdf?src-supplier=Avnet; ComponentLink3URL: https://datasheet.ciiva.com/11718/0900766b8024dedf-11718881.pdf?src-supplier=RSComponents; ComponentLink3Description: https://datasheet.ciiva.com/11718/0900766b8024dedf-11718881.pdf?src-supplier=RSComponents; ComponentLink4URL: https://datasheet.ciiva.com/1454/1631139-1454948.pdf?src-supplier=Farnell; ComponentLink4Description: https://datasheet.ciiva.com/1454/1631139-1454948.pdf?src-supplier=Farnell; ComponentLink5URL: https://datasheet.ciiva.com/19473/884011-19473046.pdf?src-supplier=Jameco; ComponentLink5Description: https://datasheet.ciiva.com/19473/884011-19473046.pdf?src-supplier=Jameco; ComponentLink6URL: https://datasheet.ciiva.com/16127/679980436450500-crimp-housings-16127855.pdf?src-supplier=Onlinecomponents.com; ComponentLink6Description: https://datasheet.ciiva.com/16127/679980436450500-crimp-housings-16127855.pdf?src-supplier=Onlinecomponents.com; ComponentLink7URL: https://datasheet.ciiva.com/16660/0436450500-crimp-housings-16660693.pdf?src-supplier=Avnet+Europe; ComponentLink7Description: https://datasheet.ciiva.com/16660/0436450500-crimp-housings-16660693.pdf?src-supplier=Avnet+Europe; ComponentLink8URL: https://datasheet.ciiva.com/1446/1597443-1446886.pdf?src-supplier=Element14; ComponentLink8Description: https://datasheet.ciiva.com/1446/1597443-1446886.pdf?src-supplier=Element14; ComponentLink9URL: https://datasheet.ciiva.com/1446/1631139-1446887.pdf?src-supplier=Element14; ComponentLink9Description: https://datasheet.ciiva.com/1446/1631139-1446887.pdf?src-supplier=Element14; ComponentLink10URL: https://datasheet.ciiva.com/14155/04401883-14155258.pdf?src-supplier=Distrelec; ComponentLink10Description: https://datasheet.ciiva.com/14155/04401883-14155258.pdf?src-supplier=Distrelec
P8 = Header 2: Header, 2-Pin; LatestRevisionDate: 17-Jul-2002; LatestRevisionNote: Re-released for DXP Platform.; Publisher: Altium Limited
Q1 = 2N7002ET1G: Trans MOSFET N-CH 60V 0.26A 3-Pin SOT-23 T/R; Manufacturer 1: ON Semiconductor; Rds On Max: 2.5R; Input Capacitance: 26.7pF; Nominal Vgs: 1V; Rise Time: 1.2ns; Number of Elements: 1; Max Power Dissipation: 300mW; Continuous Drain Current (ID): 260mA; Turn-Off Delay Time: 4.8ns; Turn-On Delay Time: 1.7ns; Element Configuration: Single; Gate to Source Voltage (Vgs): 20V; Supplier 1: Digi-Key; Manufacturer Part Number 1: 2N7002ET1G; Stock 1: 17179; Pricing 1: 1=0.18000, 10=0.16300, 25=0.15520, 100=0.06820, 250=0.06548, 500=0.05356, 1000=0.03720 (USD); RoHS: Yes; Case/Package: SOT-23-3; Number of Pins: 3; Min Operating Temperature: -55°C; Max Operating Temperature: 150°C; Package Quantity: 3000; Packaging: Tape and Reel; Drain to Source Breakdown Voltage: 60V; Fall Time: 1.2ns; Power Dissipation: 300mW; Drain to Source Resistance: 2.5R; Threshold Voltage: 1V; On-State Resistance: 2.5R; Length: 2.9mm; Height: 0.94mm; Width: 1.3mm; Radiation Hardening: No; REACH SVHC: No SVHC; Lead Free: Lead Free; Halogen Free: Halogen Free; ComponentLink1URL: https://datasheet.ciiva.com/936/2n7002e-d-936787.pdf?src-supplier=Digi-Key; ComponentLink1Description: https://datasheet.ciiva.com/936/2n7002e-d-936787.pdf?src-supplier=Digi-Key; ComponentLink2URL: https://datasheet.ciiva.com/8059/2n7002e-d-8059427.pdf?src-supplier=Element14; ComponentLink2Description: https://datasheet.ciiva.com/8059/2n7002e-d-8059427.pdf?src-supplier=Element14; ComponentLink3URL: https://datasheet.ciiva.com/13060/2n7002e-d-105476-13060091.pdf?src-supplier=Mouser; ComponentLink3Description: https://datasheet.ciiva.com/13060/2n7002e-d-105476-13060091.pdf?src-supplier=Mouser; ComponentLink4URL: https://datasheet.ciiva.com/26146/2n7002e-d-26146200.pdf?src-supplier=Avnet+Europe; ComponentLink4Description: https://datasheet.ciiva.com/26146/2n7002e-d-26146200.pdf?src-supplier=Avnet+Europe; ComponentLink5URL: https://datasheet.ciiva.com/49018/70339334-49018202.pdf?src-supplier=Allied+Electronics; ComponentLink5Description: https://datasheet.ciiva.com/49018/70339334-49018202.pdf?src-supplier=Allied+Electronics; ComponentLink6URL: https://datasheet.ciiva.com/22641/1708226-22641627.pdf?src-supplier=Element14; ComponentLink6Description: https://datasheet.ciiva.com/22641/1708226-22641627.pdf?src-supplier=Element14; ComponentLink7URL: https://datasheet.ciiva.com/22641/1708226-22641628.pdf?src-supplier=Element14; ComponentLink7Description: https://datasheet.ciiva.com/22641/1708226-22641628.pdf?src-supplier=Element14; ComponentLink8URL: https://datasheet.ciiva.com/936/2n7002e-d-936788.pdf?src-supplier=Digi-Key; ComponentLink8Description: https://datasheet.ciiva.com/936/2n7002e-d-936788.pdf?src-supplier=Digi-Key; ComponentLink9URL: https://datasheet.ciiva.com/936/2n7002e-d-936789.pdf?src-supplier=Digi-Key; ComponentLink9Description: https://datasheet.ciiva.com/936/2n7002e-d-936789.pdf?src-supplier=Digi-Key; ComponentLink10URL: https://datasheet.ciiva.com/3304/2n7002e-d-3304389.pdf?src-supplier=Avnet; ComponentLink10Description: https://datasheet.ciiva.com/3304/2n7002e-d-3304389.pdf?src-supplier=Avnet; ComponentLink11URL: https://datasheet.ciiva.com/3304/2n7002e-d-3304390.pdf?src-supplier=Avnet; ComponentLink11Description: https://datasheet.ciiva.com/3304/2n7002e-d-3304390.pdf?src-supplier=Avnet; ComponentLink12URL: https://datasheet.ciiva.com/15198/getdatasheetpartid-53846-15198758.pdf?src-supplier=Verical; ComponentLink12Description: https://datasheet.ciiva.com/15198/getdatasheetpartid-53846-15198758.pdf?src-supplier=Verical; ComponentLink13URL: https://datasheet.ciiva.com/16305/2n7002e-d-16305452.pdf?src-supplier=Future+Electronics; ComponentLink13Description: https://datasheet.ciiva.com/16305/2n7002e-d-16305452.pdf?src-supplier=Future+Electronics; Supplier Part Number 1: 2N7002ET1GOSCT-ND
Q2 Q3 = BSC093N04LSG: Trans MOSFET N-CH 40V 13A 8-Pin TDSON T/R; Manufacturer 1: Infineon; Input Capacitance: 1.9nF; Max Power Dissipation: 35W; Rds On Max: 9.3mR; Rise Time: 2.4ns; Continuous Drain Current (ID): 49A; Fall Time: 2.8ns; Power Dissipation: 2.5W; Turn-Off Delay Time: 16ns; Turn-On Delay Time: 3.6ns; Gate to Source Voltage (Vgs): 20V; Threshold Voltage: 1.2V; Element Configuration: Single; Supplier 1: Digi-Key; Manufacturer Part Number 1: BSC093N04LSG; Stock 1: 55136; Pricing 1: 1=0.75000, 10=0.66400, 25=0.62360, 100=0.45270, 500=0.37826, 1000=0.32192, 2500=0.30180 (USD); RoHS: Yes; Number of Pins: 8; Contact Plating: Tin,Matte; Min Operating Temperature: -55°C; Max Operating Temperature: 150°C; Packaging: Tape and Reel; Drain to Source Voltage (Vdss): 40V; Package Quantity: 1; Drain to Source Breakdown Voltage: 40V; Drain to Source Resistance: 9.3mR; Length: 6.35mm; Height: 1.1mm; Width: 5.35mm; REACH SVHC: No SVHC; Halogen Free: Halogen Free; ComponentLink1URL: https://datasheet.ciiva.com/6368/infineon-bsc093n04lsg-ds-v02-01-en-6368839.pdf?src-supplier=Digi-Key; ComponentLink1Description: https://datasheet.ciiva.com/6368/infineon-bsc093n04lsg-ds-v02-01-en-6368839.pdf?src-supplier=Digi-Key; ComponentLink2URL: https://datasheet.ciiva.com/6368/infineon-bsc093n04lsg-ds-v02-01-en-6368842.pdf?src-supplier=Digi-Key; ComponentLink2Description: https://datasheet.ciiva.com/6368/infineon-bsc093n04lsg-ds-v02-01-en-6368842.pdf?src-supplier=Digi-Key; ComponentLink3URL: https://datasheet.ciiva.com/6368/infineon-bsc093n04lsg-ds-v02-01-en-6368845.pdf?src-supplier=Digi-Key; ComponentLink3Description: https://datasheet.ciiva.com/6368/infineon-bsc093n04lsg-ds-v02-01-en-6368845.pdf?src-supplier=Digi-Key; ComponentLink4URL: https://datasheet.ciiva.com/11171/infineon-bsc093n04lsg-ds-v02-01-en-11171887.pdf?src-supplier=Avnet; ComponentLink4Description: https://datasheet.ciiva.com/11171/infineon-bsc093n04lsg-ds-v02-01-en-11171887.pdf?src-supplier=Avnet
Q4 = PMV40UN2R: PMV40UN2 Series 30 V 44 mOhm 3.7 A SMT N-Channel TrenchMOS FET - TO-236AB; Manufacturer 1: Nexperia; Supplier 1: Digi-Key; Manufacturer Part Number 1: PMV40UN2R; Stock 1: 189039; Pricing 1: 1=0.39000, 10=0.29300, 25=0.26400, 100=0.13920, 500=0.12336, 1000=0.09600 (USD); RoHS: No; ComponentLink1URL: http://www.farnell.com/datasheets/2242071.pdf?src-supplier=Farnell; ComponentLink1Description: http://www.farnell.com/datasheets/2242071.pdf?src-supplier=Farnell; ComponentLink2URL: http://www.farnell.com/datasheets/2242071.pdf?src-supplier=Newark; ComponentLink2Description: http://www.farnell.com/datasheets/2242071.pdf?src-supplier=Newark; ComponentLink3URL: http://www.farnell.com/datasheets/2242071.pdf?src-supplier=Element14; ComponentLink3Description: http://www.farnell.com/datasheets/2242071.pdf?src-supplier=Element14
R1 R2 = 1M_0603_1%_1/10W: Yageo RC Series Thick Film Surface Mount Resistor 0603 Case 1M 1% 0.1W 100ppm/C; Manufacturer Part Number 1: RC0603FR-071ML; Voltage Rating: 50V; Resistance: 1MR; Power Rating: 100mW; Temperature Coefficient: 100ppm/°C; Supplier 1: Digi-Key; Manufacturer 1: Yageo; Stock 1: 1716035; Pricing 1: 1=0.10000, 10=0.02200, 100=0.00900, 1000=0.00405, 2500=0.00352 (USD); RoHS: Yes; Case/Package: 0603; Number of Pins: 2; Case Code (Imperial): 0603; Case Code (Metric): 1608; Min Operating Temperature: -55°C; Max Operating Temperature: 155°C; Voltage Rating (DC): 50V; Tolerance: 1%; Packaging: Tape and Reel; Package Quantity: 5000; Termination: SMD/SMT; Composition: Thick Film; Military Standard: Not; Length: 1.6mm; Height: 0.45mm; Width: 0.8mm; Depth: 0.8mm; REACH SVHC: No SVHC; Lead Free: Lead Free; ComponentLink1URL: https://datasheet.ciiva.com/11819/0900766b80f96399-11819295.pdf?src-supplier=RSComponents; ComponentLink1Description: https://datasheet.ciiva.com/11819/0900766b80f96399-11819295.pdf?src-supplier=RSComponents; ComponentLink2URL: https://datasheet.ciiva.com/7983/443971-7983614.pdf?src-supplier=Element14; ComponentLink2Description: https://datasheet.ciiva.com/7983/443971-7983614.pdf?src-supplier=Element14; ComponentLink3URL: https://datasheet.ciiva.com/12555/rc0603-272842-12555388.pdf?src-supplier=Mouser; ComponentLink3Description: https://datasheet.ciiva.com/12555/rc0603-272842-12555388.pdf?src-supplier=Mouser; Supplier Part Number 1: 311-1.00MHRCT-ND
R3 R5 R16 = 10K_0603_1%_1/10W: RES SMD 10K OHM 1% 1/10W 0603; Manufacturer 1: Yageo; Manufacturer Part Number 1: RC0603FR-0710KL; Resistance: 10kR; Temperature Coefficient: 100ppm/°C; Voltage Rating (DC): 50V; Power Rating: 100mW; Voltage Rating: 75V; Supplier 1: Digi-Key; Stock 1: 60214900; Pricing 1: 1=0.10000, 10=0.02300, 100=0.00940, 1000=0.00421, 2500=0.00366 (USD); RoHS: Yes; Case/Package: 0603; Number of Pins: 2; Weight: 7.1E-05oz; Case Code (Imperial): 0603; Case Code (Metric): 1608; Min Operating Temperature: -55°C; Max Operating Temperature: 155°C; Tolerance: 1%; Composition: Thick Film; Packaging: Tape and Reel; Military Standard: Not; Termination: SMD/SMT; Length: 1.6mm; Height: 0.45mm; Width: 0.8mm; Depth: 0.8mm; Lead Pitch: 0.3mm; REACH SVHC: No SVHC; Lead Free: Lead Free; ComponentLink1URL: https://datasheet.ciiva.com/7660/38590-7660789.pdf?src-supplier=Element14; ComponentLink1Description: https://datasheet.ciiva.com/7660/38590-7660789.pdf?src-supplier=Element14; ComponentLink2URL: https://datasheet.ciiva.com/15189/getdatasheetpartid-409289-15189591.pdf?src-supplier=Verical; ComponentLink2Description: https://datasheet.ciiva.com/15189/getdatasheetpartid-409289-15189591.pdf?src-supplier=Verical; ComponentLink3URL: https://datasheet.ciiva.com/46440/1868787-46440891.pdf?src-supplier=Element14; ComponentLink3Description: https://datasheet.ciiva.com/46440/1868787-46440891.pdf?src-supplier=Element14; ComponentLink4URL: https://datasheet.ciiva.com/7983/443971-7983596.pdf?src-supplier=Element14; ComponentLink4Description: https://datasheet.ciiva.com/7983/443971-7983596.pdf?src-supplier=Element14; ComponentLink5URL: https://datasheet.ciiva.com/7746/1738695-7746239.pdf?src-supplier=Element14; ComponentLink5Description: https://datasheet.ciiva.com/7746/1738695-7746239.pdf?src-supplier=Element14; ComponentLink6URL: https://datasheet.ciiva.com/22747/443971-22747519.pdf?src-supplier=Element14; ComponentLink6Description: https://datasheet.ciiva.com/22747/443971-22747519.pdf?src-supplier=Element14; Supplier Part Number 1: 311-10.0KHRDKR-ND
R4 R9 R18-R20 R22 R23 R25 R27 R28 = 100R_0603_5%_1/10W: Res Thick Film 0603 100 Ohm 5% 0.1W(1/10W) ±100ppm/C Molded SMD Paper T/R; Manufacturer 1: Yageo; Manufacturer Part Number 1: RC0603JR-07100RL; Power Rating: 100mW; Voltage Rating: 50V; Temperature Coefficient: 100ppm/°C; Supplier 1: Digi-Key; Stock 1: 6886393; Pricing 1: 1=0.10000, 10=0.01800, 100=0.00740, 1000=0.00334, 2500=0.00290 (USD); RoHS: Yes; Case/Package: 0603; Number of Pins: 2; Case Code (Imperial): 0603; Case Code (Metric): 1608; Contact Plating: Tin,Matte; Min Operating Temperature: -55°C; Max Operating Temperature: 155°C; Resistance: 100R; Tolerance: 5%; Packaging: Tape and Reel; Voltage Rating (DC): 50V; Termination: SMD/SMT; Composition: Thick Film; Military Standard: Not; Length: 1.6mm; Width: 0.8mm; Depth: 0.8mm; Radiation Hardening: No; REACH SVHC: Unknown; Lead Free: Lead Free; ComponentLink1URL: https://datasheet.ciiva.com/15189/getdatasheetpartid-325207-15189846.pdf?src-supplier=Verical; ComponentLink1Description: https://datasheet.ciiva.com/15189/getdatasheetpartid-325207-15189846.pdf?src-supplier=Verical; ComponentLink2URL: https://datasheet.ciiva.com/7746/443971-7746425.pdf?src-supplier=Element14; ComponentLink2Description: https://datasheet.ciiva.com/7746/443971-7746425.pdf?src-supplier=Element14; ComponentLink3URL: https://datasheet.ciiva.com/8883/pyu-rc0603-51-rohs-l-4-8883047.pdf?src-supplier=Avnet; ComponentLink3Description: https://datasheet.ciiva.com/8883/pyu-rc0603-51-rohs-l-4-8883047.pdf?src-supplier=Avnet; ComponentLink4URL: https://datasheet.ciiva.com/7746/443971-7746426.pdf?src-supplier=Element14; ComponentLink4Description: https://datasheet.ciiva.com/7746/443971-7746426.pdf?src-supplier=Element14; Supplier Part Number 1: 311-100GRCT-ND